# EAGLE design Atmega162_expansion_2 (EAGLE 4.16)
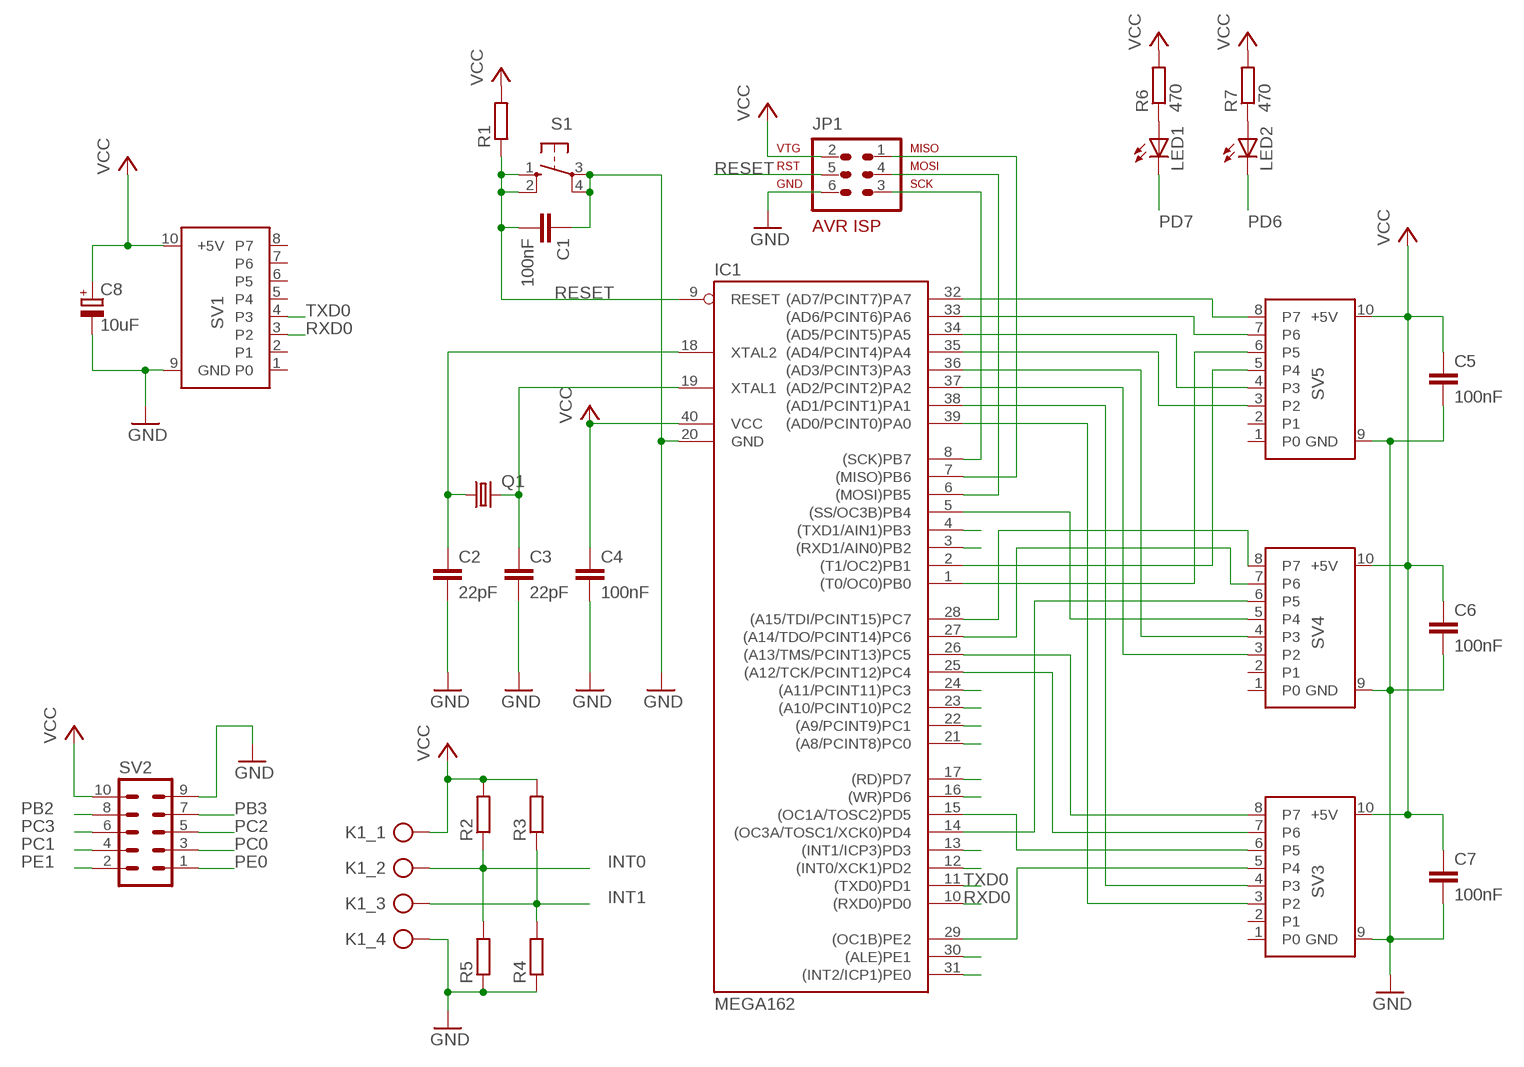
[diagram p0: schematic, sheet 1]

## Parts
C1  100nF  C-EU050-024X044  [C050-024X044]
C2  22pF  C-EU025-024X044  [C025-024X044]
C3  22pF  C-EU025-024X044  [C025-024X044]
C4  100nF  C-EU050-024X044  [C050-024X044]
C5  100nF  C-EU050-024X044  [C050-024X044]
C6  100nF  C-EU050-024X044  [C050-024X044]
C7  100nF  C-EU050-024X044  [C050-024X044]
C8  10uF  CPOL-EUE2.5-6  [E2,5-6]
IC1  MEGA162  [DIL40]
JP1  AVR-ISP-6  [AVR-ISP-6]
K1  AST021-04  [AST021-04]
LED1  LED3MM  [LED3MM]
LED2  LED3MM  [LED3MM]
Q1  CRYTALHC49U-V  [HC49U-V]
R1  R-EU_0207/7  [0207/7]
R2  R-EU_0207/7  [0207/7]
R3  R-EU_0207/7  [0207/7]
R4  R-EU_0207/7  [0207/7]
R5  R-EU_0207/7  [0207/7]
R6  470  R-EU_0207/7  [0207/7]
R7  470  R-EU_0207/7  [0207/7]
S1  10-XX  [B3F-10XX]
SV1  PORT_WANNSTECKER  [ML10]
SV2  MA05-2  [MA05-2]
SV3  PORT_WANNSTECKER  [ML10]
SV4  PORT_WANNSTECKER  [ML10]
SV5  PORT_WANNSTECKER  [ML10]

## Nets
GND: C1.1 C2.2 C3.2 C4.2 C5.2 C6.2 C7.2 C8.- IC1.20(GND) JP1.6 K1.4 R4.1 R5.1 S1.3(P) S1.4(P1) SV1.9(GND) SV2.9 SV3.9(GND) SV4.9(GND) SV5.9(GND)
INT0: IC1.12((INT0/XCK1)PD2) K1.2 R2.1 R5.2
INT1: IC1.13((INT1/ICP3)PD3) K1.3 R3.1 R4.2
MISO: IC1.7((MISO)PB6) JP1.1
MOSI: IC1.6((MOSI)PB5) JP1.4
N$1: IC1.28((A15/TDI/PCINT15)PC7) SV4.8(P7)
N$2: IC1.15((OC1A/TOSC2)PD5) SV3.6(P5)
N$3: C2.1 IC1.18(XTAL2) Q1.1
N$4: C3.1 IC1.19(XTAL1) Q1.2
N$5: IC1.29((OC1B)PE2) SV3.5(P4)
N$6: IC1.14((OC3A/TOSC1/XCK0)PD4) SV4.6(P5)
N$7: IC1.5((SS/OC3B)PB4) SV4.5(P4)
N$8: IC1.1((T0/OC0)PB0) SV5.6(P5)
N$9: IC1.2((T1/OC2)PB1) SV5.5(P4)
N$10: IC1.27((A14/TDO/PCINT14)PC6) SV4.7(P6)
N$11: IC1.26((A13/TMS/PCINT13)PC5) SV3.8(P7)
N$12: IC1.25((A12/TCK/PCINT12)PC4) SV3.7(P6)
N$13: LED1.A R6.1
N$14: LED2.A R7.1
N$15: IC1.34((AD5/PCINT5)PA5) SV5.4(P3)
N$16: IC1.35((AD4/PCINT4)PA4) SV5.3(P2)
N$17: IC1.36((AD3/PCINT3)PA3) SV4.4(P3)
N$18: IC1.37((AD2/PCINT2)PA2) SV4.3(P2)
N$19: IC1.38((AD1/PCINT1)PA1) SV3.4(P3)
N$20: IC1.39((AD0/PCINT0)PA0) SV3.3(P2)
N$21: IC1.32((AD7/PCINT7)PA7) SV5.8(P7)
N$22: IC1.33((AD6/PCINT6)PA6) SV5.7(P6)
PB2: IC1.3((RXD1/AIN0)PB2) SV2.8
PB3: IC1.4((TXD1/AIN1)PB3) SV2.7
PC0: IC1.21((A8/PCINT8)PC0) SV2.3
PC1: IC1.22((A9/PCINT9)PC1) SV2.4
PC2: IC1.23((A10/PCINT10)PC2) SV2.5
PC3: IC1.24((A11/PCINT11)PC3) SV2.6
PD6: IC1.16((WR)PD6) LED2.K(C)
PD7: IC1.17((RD)PD7) LED1.K(C)
PE0: IC1.31((INT2/ICP1)PE0) SV2.1
PE1: IC1.30((ALE)PE1) SV2.2
RESET: C1.2 IC1.9(RESET) JP1.5 R1.1 S1.1(S) S1.2(S1)
RXD0: IC1.10((RXD0)PD0) SV1.3(P2)
SCK: IC1.8((SCK)PB7) JP1.3
TXD0: IC1.11((TXD0)PD1) SV1.4(P3)
VCC: C4.1 C5.1 C6.1 C7.1 C8.+ IC1.40(VCC) JP1.2 K1.1 R1.2 R2.2 R3.2 R6.2 R7.2 SV1.10(+5V) SV2.10 SV3.10(+5V) SV4.10(+5V) SV5.10(+5V)
Unconnected: SV1.1(P0) SV1.2(P1) SV1.5(P4) SV1.6(P5) SV1.7(P6) SV1.8(P7) SV3.1(P0) SV3.2(P1) SV4.1(P0) SV4.2(P1) SV5.1(P0) SV5.2(P1)

## Library data of the parts
C1-C7 = rcl:C-EU: CAPACITOR, European symbol
C8 = rcl:CPOL-EU: POLARIZED CAPACITOR, European symbol
IC1 = atmega162:MEGA162: MICROCONTROLLER 16 Kbytes FLASH 512 bytes EEPROM 1 Kbytes SRAM dual UART hardware multiplier Source: avr.lbr
JP1 = atmel-1:AVR-ISP-6: AVR ISP-6 Serial Programming Header
K1 = 01-Klemmen:AST021-04
LED1 LED2 = led:LED: LED OSRAM: - CHIPLED LG R971, LG N971, LY N971, LG Q971, LY Q971, LO R971, LY R971 LH N974, LH R974 LS Q976, LO Q976, LY Q976 LO Q996 - Hyper CHIPLED LW Q18S LB Q993, LB Q99A, LB R99A - SideLED LS A670, LO A670, LY A670, LG A670, LP A670 LB A673, LV A673, LT A673, LW A673 LH A674 LY A675 LS A676, LA A676, LO A676, LY A676, LW A676 LS A679, LY A679, LG A679 - Hyper Micro SIDELED® LS Y876, LA Y876, LO Y876, LY Y876 LT Y87S - SmartLED LW L88C, LW L88S LB L89C, LB L89S, LG L890 LS L89K, LO L89K, LY L89K LS L896, LA L896, LO L896, LY L896 - TOPLED LS T670, LO T670, LY T670, LG T670, LP T670 LSG T670, LSP T670, LSY T670, LOP T670, LYG T670 LG T671, LOG T671, LSG T671 LB T673, LV T673, LT T673, LW T673 LH T674 LS T676, LA T676, LO T676, LY T676, LB T676, LH T676, LSB T676, LW T676 LB T67C, LV T67C, LT T67C, LS T67K, LO T67K, LY T67K, LW E67C LS E67B, LA E67B, LO E67B, LY E67B, LB E67C, LV E67C, LT E67C LW T67C LS T679, LY T679, LG T679 LS T770, LO T770, LY T770, LG T770, LP T770 LB T773, LV T773, LT T773, LW T773 LH T774 LS E675, LA E675, LY E675, LS T675 LS T776, LA T776, LO T776, LY T776, LB T776 LHGB T686 LT T68C, LB T68C - Hyper Mini TOPLED® LB M676 - Mini TOPLED Santana® LG M470 LS M47K, LO M47K, LY M47K Source: http://www.osram.convergy.de/
Q1 = crystal:CRYTAL: CRYSTAL
R1-R7 = rcl:R-EU_: RESISTOR, European symbol
S1 = switch-omron:10-XX: OMRON SWITCH
SV1 SV3-SV5 = 01-Steckverbinder:PORT_WANNSTECKER
SV2 = con-lstb:MA05-2: PIN HEADER

## Board
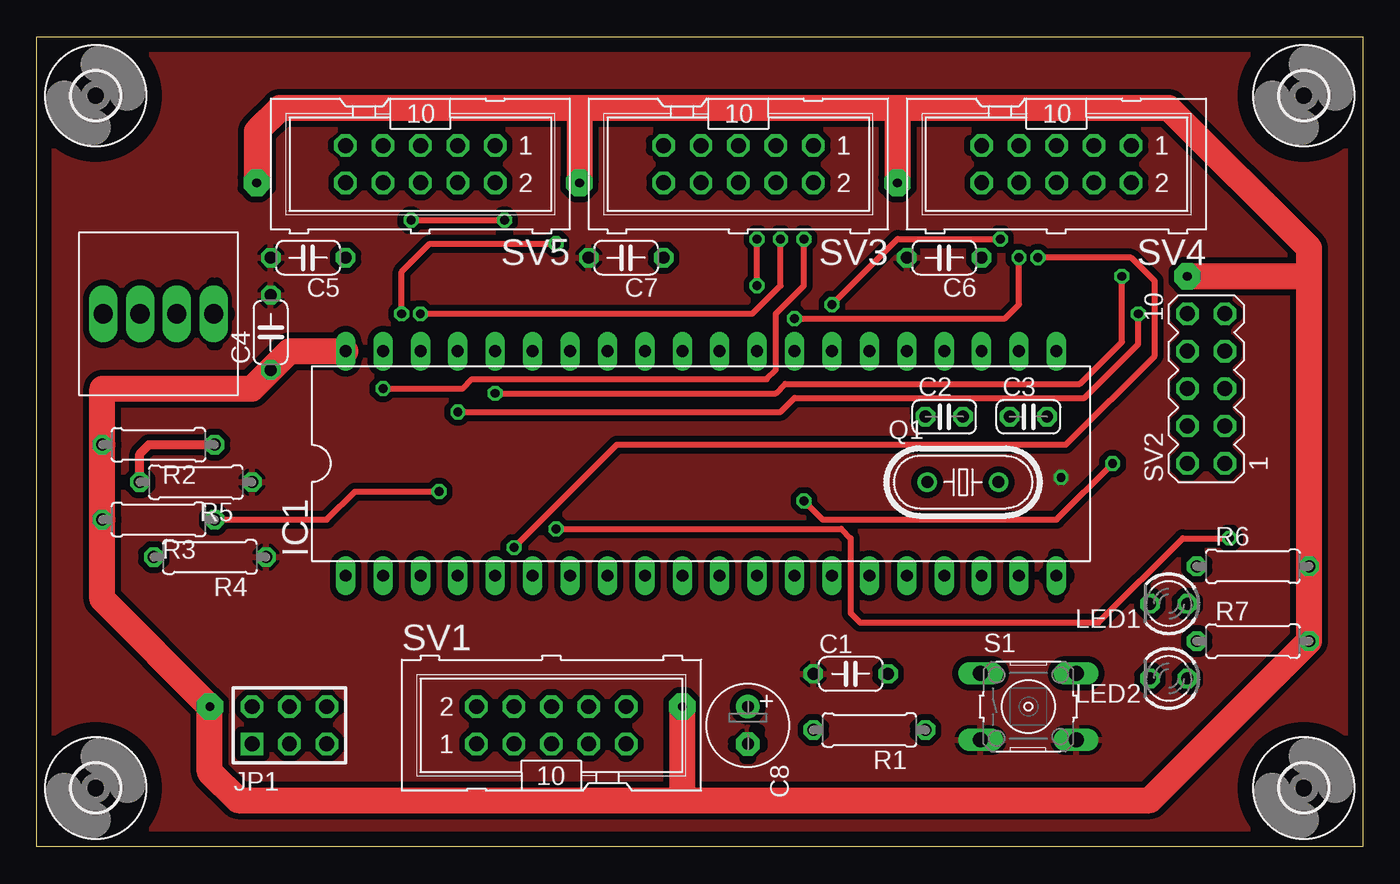
[diagram p1: board, top side]
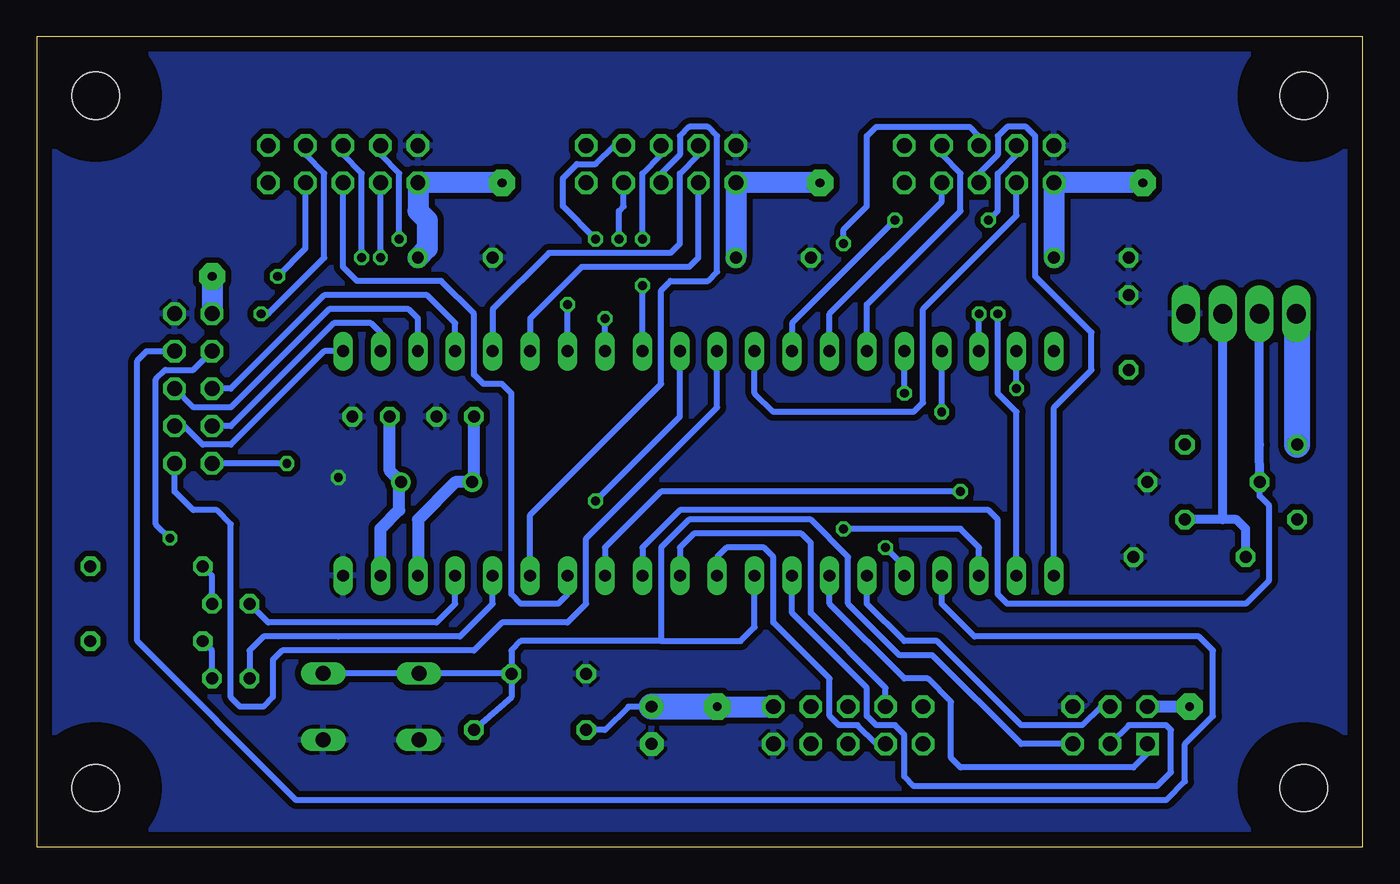
[diagram p2: board, bottom side, seen from below]

Size 90 x 55 mm. Coordinates in mm from the lower left corner, seen from the top.
Outline: 0,0 0,55 90,55 90,0 0,0
Copper layers (1*16): Top 0.035mm / dielectric 1.5mm / Bottom 0.035mm
Design rules "default": minimum track width 0.4mm, minimum drill 0.6mm, track to track 8mil, track to pad 8mil, pad to pad 8mil, via to via 8mil, smd to smd 8mil, copper to edge 40mil, drill to drill 8mil, minimum pad ring 10mil, minimum via ring 8mil, stop-mask expansion 4mil, vias tented up to drill 0mil, thermal gap 10mil
tRestrict: 44 lines

### Footprints (pad centres in the part's own frame; a part is rotated, then mirrored left to right if it is on the bottom)
C050-024X044 = drill 0.813 octagon: 1 -2.54,0; 2 2.54,0
C025-024X044 = drill 0.813 octagon: 1 -1.27,0; 2 1.27,0
E2,5-6 = drill 0.813 pad 1.6 round: + -1.27,0 | drill 0.813 pad 1.6 octagon: - 1.27,0
DIL40 = drill 0.813 long: 1 -24.13,-7.62; 2 -21.59,-7.62; 3 -19.05,-7.62; 4 -16.51,-7.62; 5 -13.97,-7.62; 6 -11.43,-7.62; 7 -8.89,-7.62; 8 -6.35,-7.62; 9 -3.81,-7.62; 10 -1.27,-7.62; 11 1.27,-7.62; 12 3.81,-7.62; 13 6.35,-7.62; 14 8.89,-7.62; 15 11.43,-7.62; 16 13.97,-7.62; 17 16.51,-7.62; 18 19.05,-7.62; 19 21.59,-7.62; 20 24.13,-7.62; 21 24.13,7.62; 22 21.59,7.62; 23 19.05,7.62; 24 16.51,7.62; 25 13.97,7.62; 26 11.43,7.62; 27 8.89,7.62; 28 6.35,7.62; 29 3.81,7.62; 30 1.27,7.62; 31 -1.27,7.62; 32 -3.81,7.62; 33 -6.35,7.62; 34 -8.89,7.62; 35 -11.43,7.62; 36 -13.97,7.62; 37 -16.51,7.62; 38 -19.05,7.62; 39 -21.59,7.62; 40 -24.13,7.62
AVR-ISP-6 = drill 1.016 square: 1 -2.54,-1.27 | drill 1.016 octagon: 2 -2.54,1.27; 3 0,-1.27; 4 0,1.27; 5 2.54,-1.27; 6 2.54,1.27
AST021-04 = drill 1.3 long: 1 -3.75,0; 2 -1.25,0; 3 1.25,0; 4 3.75,0
LED3MM = drill 0.813 octagon: A -1.27,0; K 1.27,0
HC49U-V = drill 0.813 round: 1 -2.413,0; 2 2.413,0
0207/7 = drill 0.813 octagon: 1 -3.81,0; 2 3.81,0
B3F-10XX = drill 1.016 long: 1 -3.251,2.261; 2 3.251,2.261; 3 -3.251,-2.261; 4 3.251,-2.261
ML10 = drill 1.016 octagon: 1 -5.08,-1.27; 2 -5.08,1.27; 3 -2.54,-1.27; 4 -2.54,1.27; 5 0,-1.27; 6 0,1.27; 7 2.54,-1.27; 8 2.54,1.27; 9 5.08,-1.27; 10 5.08,1.27
MA05-2 = drill 1.016 octagon: 1 -5.08,-1.27; 2 -5.08,1.27; 3 -2.54,-1.27; 4 -2.54,1.27; 5 0,-1.27; 6 0,1.27; 7 2.54,-1.27; 8 2.54,1.27; 9 5.08,-1.27; 10 5.08,1.27
3,2 = hole 3.2: 0,0

### Placement (x,y rotation side)
C1  55.24,11.75 0 top
C2  61.59,29.21 0 top
C3  67.31,29.21 0 top
C4  15.88,34.92 90 top
C5  18.41,40.01 180 top
C6  61.59,40.01 180 top
C7  40.01,40.01 180 top
C8  48.26,8.26 270 top
IC1  45.09,26.04 0 top
JP1  17.14,8.26 0 top
K1  8.26,36.2 0 top
LED1  76.83,16.51 180 top
LED2  76.83,11.43 180 top
Q1  62.87,24.77 0 top
R1  56.52,7.94 180 top
R2  8.26,27.3 180 top
R3  8.26,22.23 180 top
R4  11.75,19.68 180 top
R5  10.79,24.77 180 top
R6  82.55,19.05 0 top
R7  82.55,13.97 0 top
S1  67.31,9.53 0 top
SV1  34.92,8.26 0 top
SV2  79.38,31.11 90 top
SV3  47.62,46.35 180 top
SV4  69.22,46.35 180 top
SV5  26.04,46.35 180 top
U$1  [3,2]  4,4 0 top
U$2  [3,2]  86,4 0 top
U$3  [3,2]  86,51 0 top
U$4  [3,2]  4,51 0 top

### Tracks (layer width: path | path; a pad name or v marks a point on that pad's centre or on a via)
GND  (via drill 0.6)
  other vias: 69.53,25.08
  pour Bottom (isolate 0.406): 0,0 0,55 90,55 90,0
  pour Top (isolate 0.406): 0,0 0,55 90,55 90,0
INT0
  Top 0.61: R2.1 7.62,27.3 6.99,26.67 R5.2
  Bottom 0.406: IC1.12 48.9,20.32 46.35,22.86 25.4,22.86 24.77,22.23 24.77,17.14 24.13,16.51 7.94,16.51 6.35,18.1 6.35,23.18 6.99,23.81 R5.2
  Bottom 0.61: K1.2 7,27.3 R5.2 7,24.77
INT1  (via drill 0.6)
  Top 0.4: 19.68,22.23 21.59,24.13 v27.3,24.13
  Top 0.406: R3.1 19.68,22.23
  Bottom 0.406: v27.3,24.13 47.62,24.13 51.44,20.32 IC1.13
  Bottom 0.61: R4.2 7.94,21.59 8.57,22.23 9.53,22.23 | 9.53,22.23 R3.1 | K1.3 9.51,22.25 9.53,22.23
MISO
  Bottom 0.406: IC1.7 36.2,16.51 31.11,11.43 29.53,11.43 27.94,9.84 27.94,6.03 27.3,5.4 15.56,5.4 14.61,6.35 JP1.1
MOSI
  Bottom 0.406: IC1.6 33.66,16.51 31.11,13.97 28.89,13.97 23.18,8.26 19.05,8.26 17.78,9.53 JP1.4
N$1  (via drill 0.6)
  Top 0.406: v51.44,35.88 65.72,35.88 66.67,36.83 v66.67,40.01
  Bottom 0.406: IC1.28 v51.44,35.88 | v66.67,40.01 SV4.8
N$2
  Bottom 0.406: IC1.15 56.52,22.54 47.62,31.43 47.62,37.78 46.99,38.42 44.45,38.42 43.81,39.05 43.81,48.26 44.45,48.9 45.72,48.9 46.35,48.26 46.35,46.99 47.62,45.72 SV3.6
N$3
  Bottom 0.813: IC1.18 64.14,22.23 61.59,24.77 Q1.1 | Q1.1 60.33,24.77 | Q1.1 60.33,24.89 C2.1
N$4
  Bottom 0.813: IC1.19 66.67,21.59 65.41,22.86 65.41,24.77 Q1.2 66.04,25.53 C3.1
N$5  (via drill 0.6)
  Top 0.406: v48.9,38.1 v48.9,41.27
  Bottom 0.406: SV3.5 47.62,46.99 48.9,45.72 v48.9,41.27 | IC1.29 v48.9,38.1
N$6
  Bottom 0.406: SV4.6 69.22,39.37 68.26,38.42 62.55,38.42 60.33,36.2 60.33,32.07 59.69,31.43 58.42,31.43 57.78,30.8 57.78,17.14 57.15,16.51 54.61,16.51 53.98,17.14 IC1.14
N$7  (via drill 0.6)
  Top 0.406: v32.38,20.32 39.37,27.3 69.85,27.3 75.88,33.34 75.88,38.42 74.3,40.01 v67.94,40.01
  Bottom 0.406: v32.38,20.32 31.11,19.05 IC1.5 | v67.94,40.01 67.94,45.72 69.22,46.99 SV4.5
N$8
  Bottom 0.406: IC1.1 20.95,29.84 18.41,32.38 18.41,34.92 22.23,38.73 22.23,48.26 22.86,48.9 24.13,48.9 24.77,48.26 24.77,46.99 26.04,45.72 SV5.6
N$9  (via drill 0.6)
  Top 0.406: v24.77,36.2 24.77,39.05 26.67,40.96 v35.24,40.96
  Bottom 0.406: v24.77,36.2 24.77,30.8 23.5,29.53 IC1.2 | v35.24,40.96 35.24,41.91 33.66,43.5 33.66,48.26 33.02,48.9 26.67,48.9 26.04,48.26 SV5.5
N$10  (via drill 0.6)
  Top 0.406: v53.98,36.83 58.42,41.27 v65.41,41.27
  Bottom 0.406: v65.41,41.27 65.41,45.72 66.67,46.99 SV4.7 | IC1.27 v53.98,36.83
N$11
  Bottom 0.406: IC1.26 56.52,35.88 53.02,39.37 45.72,39.37 45.09,40.01 SV3.8
N$12
  Bottom 0.406: IC1.25 59.05,36.51 55.24,40.32 46.99,40.32 46.35,40.96 46.35,45.72 45.09,46.99 SV3.7
N$13
  Bottom 0.406: LED1.A 78.11,18.41 R6.1
N$14
  Bottom 0.406: LED2.A 78.11,13.34 R7.1
N$15
  Bottom 0.406: IC1.34 36.2,36.2 28.57,43.81 SV5.4
N$16
  Bottom 0.406: IC1.35 33.66,36.83 27.3,43.18 27.3,45.72 28.57,46.99 SV5.3
N$17  (via drill 0.6)
  Top 0.406: v73.66,38.73 73.66,34.29 70.8,31.43 50.8,31.43 50.16,30.8 v31.11,30.8
  Bottom 0.406: v73.66,38.73 71.75,40.64 SV4.4 | v31.11,30.8 IC1.36
N$18  (via drill 0.6)
  Top 0.406: v28.57,29.53 50.48,29.53 51.44,30.48 71.12,30.48 74.77,34.13 v74.77,36.2
  Bottom 0.406: v28.57,29.53 IC1.37 | SV4.3 71.75,46.99 70.48,45.72 70.48,40.01 74.3,36.2 v74.77,36.2
N$19  (via drill 0.6)
  Top 0.406: v26.04,36.2 48.58,36.2 50.48,38.1 v50.48,41.27
  Bottom 0.406: IC1.38 v26.04,36.2 | v50.48,41.27 50.48,43.18 50.16,43.5 SV3.4
N$20  (via drill 0.6)
  Top 0.406: v23.5,31.11 28.89,31.11 29.53,31.75 49.53,31.75 50.16,32.38 50.16,36.2 52.07,38.1 v52.07,41.27
  Bottom 0.406: v52.07,41.27 54.29,43.5 54.29,45.4 53.34,46.35 52.07,46.35 50.8,47.62 SV3.3 | v23.5,31.11 IC1.39
N$21
  Bottom 0.406: IC1.32 41.27,30.8 40.01,29.53 30.48,29.53 29.84,30.16 29.84,36.51 23.5,42.86 SV5.8
N$22  (via drill 0.6)
  Top 0.406: v25.4,42.55 v31.75,42.55
  Bottom 0.406: v31.75,42.55 38.73,35.56 IC1.33 | v25.4,42.55 24.77,43.18 24.77,45.72 23.5,46.99 SV5.7
PB2  (via drill 0.6)
  Top 0.406: v35.24,21.59 54.61,21.59 55.24,20.95 55.24,15.88 55.88,15.24 72.07,15.24 77.79,20.95 v80.96,20.95
  Bottom 0.406: v35.24,21.59 27.3,21.59 26.04,20.32 IC1.3 | v80.96,20.95 81.92,21.91 81.92,31.75 81.28,32.38 79.38,32.38 SV2.8
PB3
  Bottom 0.406: IC1.4 28.57,16.51 26.35,14.29 11.11,14.29 10.16,13.34 10.16,8.89 12.06,6.99 12.06,4.45 13.34,3.17 72.39,3.17 83.19,13.97 83.19,33.02 82.55,33.66 SV2.7
PC0
  Bottom 0.406: IC1.21 70.48,33.66 76.83,27.3 78.74,27.3 80.01,28.57 SV2.3
PC1
  Bottom 0.406: IC1.22 66.67,34.92 67.31,35.56 69.85,35.56 76.83,28.57 SV2.4
PC2
  Bottom 0.406: IC1.23 64.14,35.88 64.77,36.51 70.17,36.51 76.83,29.84 79.38,29.84 SV2.5
PC3
  Bottom 0.406: IC1.24 61.59,35.56 63.5,37.47 70.48,37.47 76.83,31.11 SV2.6
PD6
  Bottom 0.406: IC1.16 59.05,16.51 61.28,14.29 69.53,14.29 74.61,14.29 75.56,13.34 LED2.K 75.41,11.59
PD7
  Bottom 0.406: 75.41,16.67 LED1.K 74.3,15.24 62.87,15.24 61.59,16.51 IC1.17
PE0
  Bottom 0.406: IC1.31 43.81,29.84 52.7,20.95 52.7,16.51 53.98,15.24 58.42,15.24 60.33,13.34 73.34,13.34 73.98,12.7 73.98,10.16 74.61,9.53 76.2,9.53 76.83,10.16 76.83,21.91 77.79,22.86 79.38,22.86 80.64,24.13 SV2.1
PE1  (via drill 0.6)
  Top 0.406: v52.07,23.5 53.34,22.23 69.22,22.23 v73.03,26.04
  Bottom 0.406: v52.07,23.5 46.35,29.21 IC1.30 | v73.03,26.04 SV2.2
RESET
  Bottom 0.406: C1.2 57.78,10.16 R1.1 | C1.2 57.78,13.34 57.15,13.97 47.62,13.97 | 47.62,13.97 42.23,13.97 41.27,14.92 IC1.9 | JP1.5 23.18,6.99 29.21,13.02 31.43,13.02 34.92,16.51 34.92,19.68 37.47,22.23 45.72,22.23 47.62,20.32 47.62,13.97 | S1.1 58.06,11.79 C1.2 | S1.1 64.14,11.79 | 64.14,11.79 S1.2 | 64.14,11.79 64.14,11.43 64.06,11.51 S1.1
RXD0
  Bottom 0.406: IC1.10 43.81,19.68 43.18,20.32 40.64,20.32 40.01,19.68 40.01,15.24 36.2,11.43 36.2,8.89 35.56,8.26 34.29,8.26 33.02,6.99 SV1.3
SCK
  Bottom 0.406: IC1.8 38.73,15.88 33.66,10.79 33.66,8.89 33.02,8.26 31.75,8.26 31.11,7.62 31.11,4.76 30.48,4.13 13.97,4.13 13.02,5.08 13.02,7.94 13.34,8.26 15.88,8.26 JP1.3
TXD0
  Bottom 0.406: IC1.11 46.35,20.32 45.4,21.27 38.1,21.27 37.47,20.64 37.47,15.88 32.38,10.79 SV1.4
VCC  (via drill 0.6 pad 1.78)
  Top 1.778: 43.81,3.17 75.56,3.17 R7.2 R6.2 86.36,38.73 | 86.36,38.73 86.36,40.64 76.83,50.16 58.42,50.16 | 58.42,50.16 v58.42,45.09 | 58.42,50.16 36.83,50.16 | 36.83,50.16 v36.83,45.09 | v14.92,45.09 14.92,48.58 16.51,50.16 36.83,50.16 | 43.81,3.17 13.65,3.17 11.75,5.08 v11.75,9.53 4.45,16.83 R3.2 R2.2 4.45,31.11 14.61,31.11 C4.1 17.14,33.66 IC1.40 | 86.36,38.73 v78.11,38.73 | 43.81,3.17 v43.81,9.53
  Bottom 0.406: C8.+ 49.85,9.53 51.44,7.94 R1.2
  Bottom 0.813: v11.75,9.53 JP1.2
  Bottom 1.422: v78.11,38.73 SV2.10 | v43.81,9.53 SV1.10 | v58.42,45.09 SV4.10 64.14,43.18 63.5,42.55 63.5,40.64 C6.1 | v14.92,45.09 SV5.10 C5.1 | C7.1 SV3.10 v36.83,45.09
  Bottom 1.778: K1.1 4.45,36.2 R2.2 | v43.81,9.53 C8.+